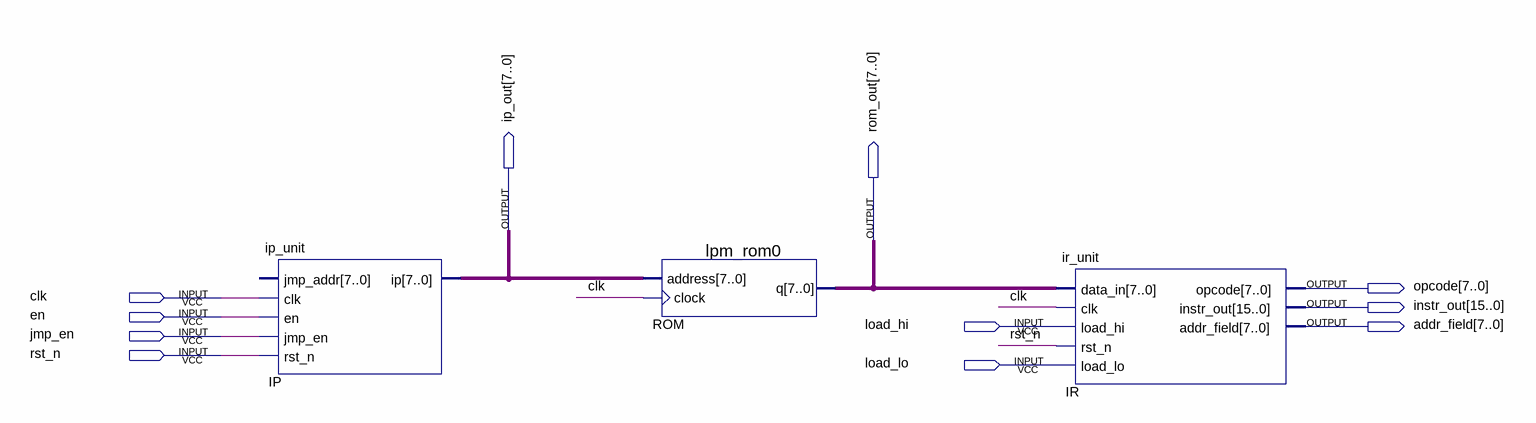
[diagram p0: schematic sheet]
// Quartus schematic fetch_chain.bdf as structural Verilog: 3 symbols, 11 pins
module fetch_chain (
  input  clk,
  input  en,
  input  load_hi,
  input  jmp_en,
  input  rst_n,
  input  load_lo,
  output [7:0] ip_out,
  output [7:0] rom_out,
  output [7:0] opcode,
  output [15:0] instr_out,
  output [7:0] addr_field
);

  ip_unit IP (.clk(clk), .en(en), .jmp_en(jmp_en), .rst_n(rst_n), .ip(ip_out));  // open: jmp_addr
  lpm_rom0 ROM (.address(ip_out), .clock(clk), .q(rom_out));
  ir_unit IR (
    .data_in(rom_out), .clk(clk), .load_hi(load_hi), .rst_n(rst_n), .load_lo(load_lo), .opcode(opcode),
    .instr_out(instr_out), .addr_field(addr_field));
endmodule
